# EasyEDA Pro project ProPrj_HTXStudio_OneHanded_Keyboard.epro, board 左手主控
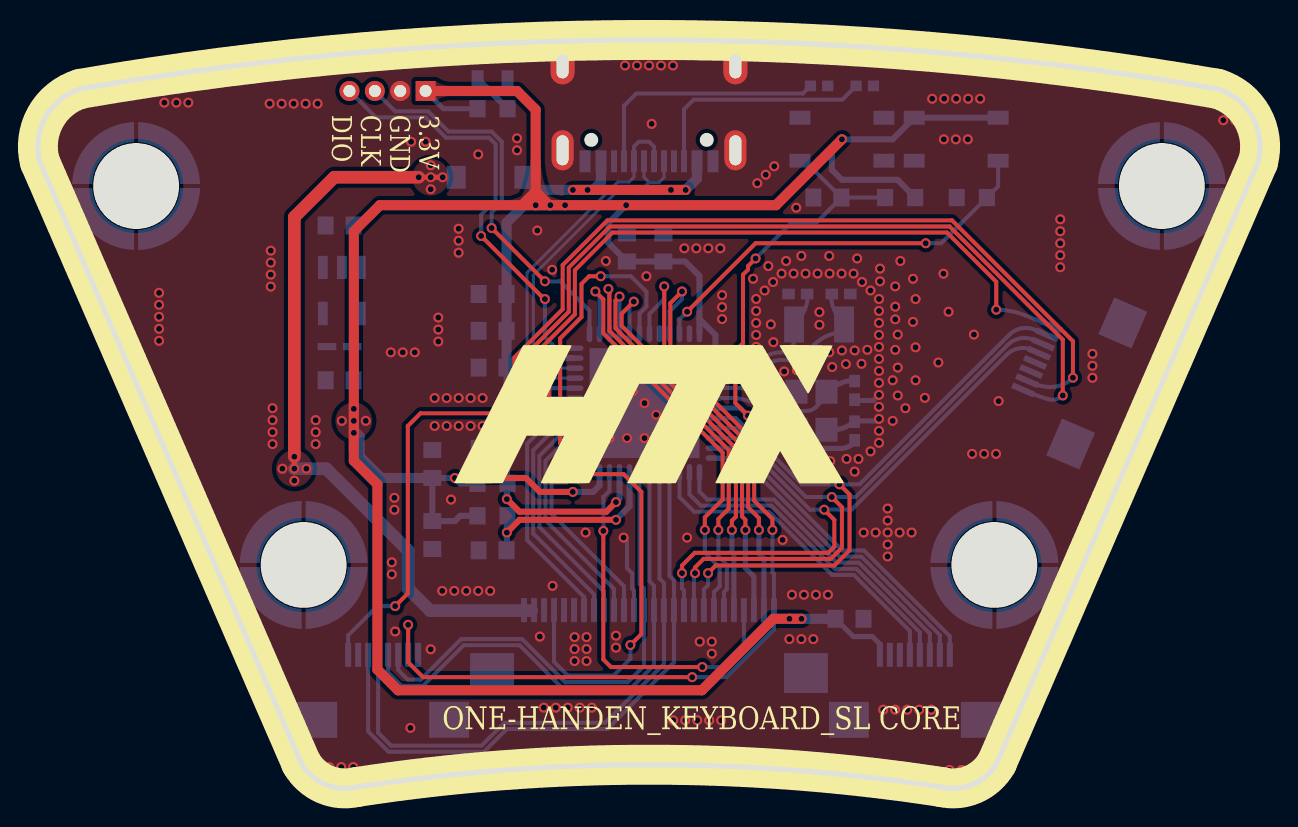
[diagram p12: board, top side]
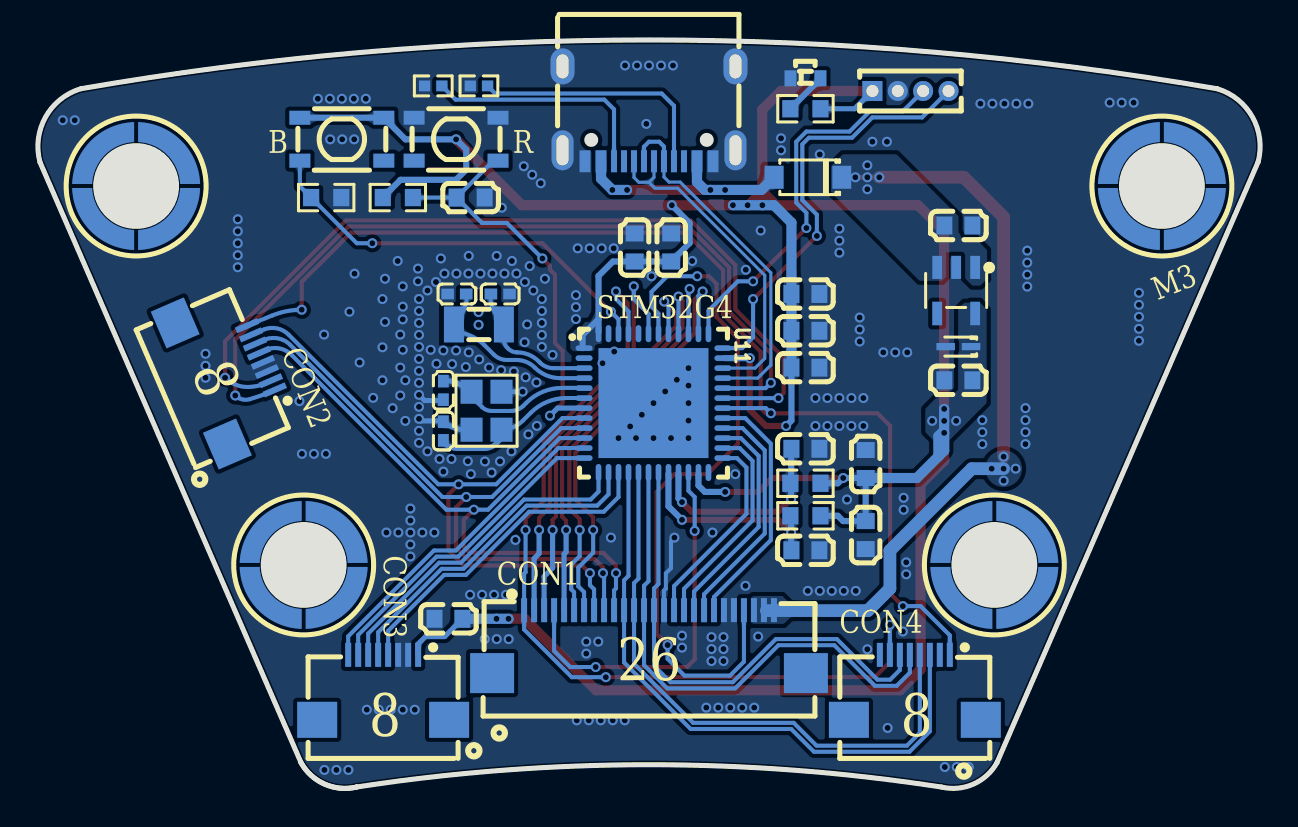
[diagram p13: board, bottom side, seen from below]

Outline 61.15 x 37.46 mm; copper layers: Top Layer, Bottom Layer. Coordinates in mm from the lower left corner of the outline.
Outline path: 45.2,0.07 arc(30.57,1.19) 15.94,0.07 arc(14.35,0.21) 13.17,1.28 0.1,31.34 arc(0.38,33.59) 2.15,35.02 arc(30.57,37.46) 59,35.02 arc(60.77,33.59) 61.04,31.34 47.98,1.28 ; 45.2,0.07 arc(46.79,0.21) 47.98,1.28 ; 45.2,0.07 arc(46.8,0.21) 47.98,1.28
Stack: Top Layer 0.035mm / Dielectric1 1.51mm FR4 er 4.5 / Bottom Layer 0.035mm

## Design rules (mm)
template: 自定义配置
spacing copperThickness1oz (default): track to track 0.102, other pairs 0.05 to 0.3
spacing copperThickness2oz: track to track 0.203, other pairs 0.152 to 0.3
track width copperThickness1oz (default): min 0.127, default 0.254, max 2.54
track width copperThickness2oz: min 0.203, default 0.254, max 2.54
differential pair differentialPair (default): width min 0.127, default 0.254, max 2.54; gap min 0.152, default 0.152
via viaSize (default): diameter min 0.4, default 0.4, max 10; hole min 0.3, default 0.3, max 6.3

## Placement (name value [footprint] x y rotation side)
C6  20pF  [C0402]  40.86 17.89 90 bottom
C7  20pF  [C0402]  40.86 19.92 90 bottom
C27  6pF  [C0402]  38.02 24.74 180 bottom
C28  6pF  [C0402]  40.18 24.74 0 bottom
C29  100nF  [C0603]  22.75 11.92 0 bottom
C30  100nF  [C0603]  19.73 12.68 270 bottom
C31  100nF  [C0603]  19.73 16.24 270 bottom
C32  100nF  [C0603]  22.75 17 180 bottom
C33  1uF  [C0603]  22.75 24.74 0 bottom
C34  100nF  [C0603]  22.75 22.9 0 bottom
C35  100nF  [C0603]  22.75 21.06 0 bottom
C36  100nF  [C0603]  39.5 29.57 0 bottom
C37  1uF  [C0603]  31.29 27.07 270 bottom
C38  100nF  [C0603]  29.46 27.07 270 bottom
C39  100nF  [C0603]  40.61 8.49 180 bottom
C40  1uF  [C0603]  15.1 28.17 0 bottom
C41  1uF  [C0603]  15.1 20.43 180 bottom
D1  DSK34  [SOD-123_L2.8-W1.8-LS3.7-RD]  22.62 30.59 0 bottom
D3  ESD5Z3V3  [SOD-523_L1.2-W0.8-LS1.6-RD]  15.1 22.11 0 bottom
FPC7  FPC-05FB-8PH20  [FPC-SMD_8P-P0.50_XUNPU_FPC-05FB-8PH20]  17.27 5.06 180 bottom
FPC8  FPC-05FB-8PH20  [FPC-SMD_8P-P0.50_XUNPU_FPC-05FB-8PH20]  43.87 5.06 180 bottom
FPC9  FPC-05FB-8PH20  [FPC-SMD_8P-P0.50_XUNPU_FPC-05FB-8PH20]  51.48 20.91 246.7 bottom
H1  PZ127V-11-04-0720  [HDR-TH_4P-P1.27-V-M]  17.49 34.9 180 bottom
LDO1  ME6211C33M5G-N  [SOT-23-5_L3.0-W1.7-P0.95-LS2.8-BL]  15.21 24.92 0 bottom
LED3  XL-1606UGC  [LED-SMD_L1.7-W1.1-R-RD_GREEN]  22.75 35.54 180 bottom
R6  5.1kΩ  [R0402]  39.08 35.16 180 bottom
R7  5.1kΩ  [R0402]  41.37 35.16 180 bottom
R10  0Ω  [R0603]  22.75 13.64 0 bottom
R11  0Ω  [R0603]  22.75 15.27 0 bottom
R12  10kΩ  [R0603]  43.14 29.57 0 bottom
R13  10kΩ  [R0603]  46.72 29.57 0 bottom
R14  1kΩ  [R0603]  22.75 34.02 0 bottom
SW1  SKRPACE010  [KEY-SMD_4P-L4.2-W3.2-P2.20-LS4.6]  40.23 32.49 180 bottom
SW2  SKRPACE010  [KEY-SMD_4P-L4.2-W3.2-P2.20-LS4.6]  45.94 32.49 180 bottom
U11  STM32G431CBU6  [VQFN-48_L7.0-W7.0-P0.50-BL-EP5.5]  30.35 19.28 270 bottom
U16  SMTSO3030CTJ  [SMD_BD5.6-D4.1]  47.85 11.18 180 bottom
U17  SMTSO3030CTJ  [SMD_BD5.6-D4.1]  13.3 11.18 180 bottom
U18  SMTSO3030CTJ  [SMD_BD5.6-D4.1]  4.91 30.15 180 bottom
U19  SMTSO3030CTJ  [SMD_BD5.6-D4.1]  56.23 30.15 180 bottom
USB1  TYPE-C 16PIN 2MD(073)  [USB-C-SMD_TYPE-C-6PIN-2MD-073]  30.57 33.76 0 bottom
X1  8MHz  [OSC-SMD_4P-L2.5-W2.0-BL]  38.7 18.9 90 bottom
X2  32.768kHz  [FC-135R_L3.2-W1.5]  39.08 23.22 180 bottom
X3  AFC24-S26FIA-00  [FPC-SMD_AFC24-S26FIA]  30.57 7.35 180 bottom

## Footprints (pads in the part's own frame, mm; a bottom-side part is the same pattern mirrored in y, then rotated)
C0402
  rect 0.63x0.54 smd: 1(-0.465,0) 2(0.465,0)
C0603
  rect 0.8x0.9 smd: 1(-0.7,0) 2(0.7,0)
FC-135R_L3.2-W1.5
  rect 1x1.8 smd: 1(-1.25,0) 2(1.25,0)
FPC-SMD_8P-P0.50_XUNPU_FPC-05FB-8PH20
  rect 0.3x1.2 smd: 1(1.75,1.625) 2(1.25,1.625) 3(0.75,1.625) 4(0.25,1.625) 5(-0.25,1.625) 6(-0.75,1.625) 7(-1.25,1.625) 8(-1.75,1.625)
  rect 2x1.8 smd: 9(-3.3,-1.625) 10(3.3,-1.625)
FPC-SMD_AFC24-S26FIA
  rect 0.3x1.2 smd: 1(-6.25,1.574) 2(-5.748,1.574) 3(-5.248,1.574) 4(-4.748,1.574) 5(-4.248,1.574) 6(-3.748,1.574) 7(-3.248,1.574) 8(-2.748,1.574) 9(-2.248,1.574) 10(-1.748,1.574) 11(-1.248,1.574) 12(-0.748,1.574) 13(-0.248,1.574) 14(0.252,1.574) 15(0.752,1.574) 16(1.252,1.574) 17(1.752,1.574) 18(2.252,1.574) 19(2.754,1.573) 20(3.252,1.574) 21(3.75,1.576) 22(4.25,1.576) 23(4.75,1.576) 24(5.25,1.576) 25(5.75,1.576) 26(6.25,1.576)
  rect 2.2x2 smd: 27(7.85,-1.576) 28(-7.85,-1.576)
HDR-TH_4P-P1.27-V-M
  rect 1x1 hole 0.6: 1(-1.905,0)
  round 1 hole 0.6: 2(-0.635,0) 3(0.635,0) 4(1.905,0)
KEY-SMD_4P-L4.2-W3.2-P2.20-LS4.6
  rect 1.05x0.7 smd: 1(-2.1,1.075) 2(2.1,1.075) 3(-2.1,-1.075) 4(2.1,-1.075)
LED-SMD_L1.7-W1.1-R-RD_GREEN
  rect 0.6x0.8 smd: 1(0.75,0) 2(-0.75,0)
OSC-SMD_4P-L2.5-W2.0-BL
  rect 1.2x1.1 smd: 1(-0.95,-0.75) 2(0.95,-0.75) 3(0.95,0.75) 4(-0.95,0.75)
R0402
  rect 0.566x0.54 smd: 1(-0.433,0) 2(0.433,0)
R0603
  rect 0.806x0.864 smd: 1(-0.753,0) 2(0.753,0)
SMD_BD5.6-D4.1
  custom 3.1x3.1 smd: 1(-2.102,1.65) 2(1.65,2.102) 3(2.102,-1.65) 4(-1.65,-2.102)
SOD-123_L2.8-W1.8-LS3.7-RD
  rect 0.95x1.15 smd: 1(-1.692,0) 2(1.692,0)
SOD-523_L1.2-W0.8-LS1.6-RD
  rect 0.93x0.36 smd: 1(-0.635,0) 2(0.635,0)
SOT-23-5_L3.0-W1.7-P0.95-LS2.8-BL
  rect 0.49x1.157 smd: 1(-0.95,-1.153) 2(0,-1.153) 3(0.95,-1.153)
  rect 0.49x1.175 smd: 4(0.95,1.153) 5(-0.95,1.153)
USB-C-SMD_TYPE-C-6PIN-2MD-073
  rect 0.55x1.1 smd: 1(-3.2,2.375) 2(-2.4,2.375) 11(2.4,2.375) 12(3.2,2.375)
  rect 0.3x1.1 smd: 3(-1.75,2.375) 4(-1.25,2.375) 5(-0.75,2.375) 6(-0.25,2.375) 7(0.25,2.375) 8(0.75,2.375) 9(1.25,2.375) 10(1.75,2.375)
  oval 1.2x1.8 hole 0.6x1.2: 13(-4.325,-2.375) 14(4.325,-2.375)
  oval 1.1x2 hole 0.6x1.5: 13(-4.325,1.825) 14(4.325,1.825)
VQFN-48_L7.0-W7.0-P0.50-BL-EP5.5
  oval 0.28x0.85 smd: 1(-2.75,-3.474) 2(-2.25,-3.474) 3(-1.75,-3.474) 4(-1.25,-3.474) 5(-0.75,-3.474) 6(-0.25,-3.474) 7(0.25,-3.474) 8(0.75,-3.474) 9(1.25,-3.474) 10(1.75,-3.474) 11(2.25,-3.474) 12(2.75,-3.474) 25(2.75,3.474) 26(2.25,3.474) 27(1.75,3.474) 28(1.25,3.474) 29(0.75,3.474) 30(0.25,3.474) 31(-0.25,3.474) 32(-0.75,3.474) 33(-1.25,3.474) 34(-1.75,3.474) 35(-2.25,3.474) 36(-2.75,3.474)
  oval 0.85x0.28 smd: 13(3.474,-2.75) 14(3.474,-2.25) 15(3.474,-1.75) 16(3.474,-1.25) 17(3.474,-0.75) 18(3.474,-0.25) 19(3.474,0.25) 20(3.474,0.75) 21(3.474,1.25) 22(3.474,1.75) 23(3.474,2.25) 24(3.474,2.75) 37(-3.474,2.75) 38(-3.474,2.25) 39(-3.474,1.75) 40(-3.474,1.25) 41(-3.474,0.75) 42(-3.474,0.25) 43(-3.474,-0.25) 44(-3.474,-0.75) 45(-3.474,-1.25) 46(-3.474,-1.75) 47(-3.474,-2.25) 48(-3.474,-2.75)
  rect 5.5x5.5 smd: 49(0,0)

## Nets
As in the schematic.

Pads without a net: FPC7 9 10; FPC8 9 10; FPC9 9 10; LDO1 4; SW1 3; SW2 4; U11 2 24 44 47; U16 1 2 3 4; U17 1 2 3 4; U18 1 2 3 4; U19 1 2 3 4; USB1 3 9; X3 27 28

## Via types
v1: diameter 0.5, hole 0.3, Top Layer to Bottom Layer, 337 vias

## Routing (per net, layer and track width the routed paths; a pad name or vN(x,y) marks a point on that pad's centre or on a via; arc(x,y) is an arc through that point)
+3.3V: length 162.3
  Top Layer w0.305: v1(25.53,21.54) 25.53,18.94 24.73,18.14 v1(23.71,18.14) ; v1(20.85,15.54) 24.41,15.54 25.11,14.84 v1(26.76,14.84)
  Top Layer w0.508: 24.22,29.19 17.11,29.19 15.8,27.89 v1(15.8,19) ; 24.22,29.19 24.9,29.87 ; 24.22,29.19 v1(24.9,29.19) ; 25.58,29.19 v1(25.63,29.19) v1(26.37,29.19) v1(29.43,29.19) 36.93,29.19 v1(40.22,32.49) ; 25.58,29.19 v1(24.9,29.19) ; 25.58,29.19 24.9,29.87 ; 15.8,18.27 v1(15.8,17.8) 15.8,16.4 16.98,15.22 16.98,5.95 18.02,4.91 33.21,4.91 36.79,8.49 v1(37.6,8.49) v1(38.2,8.49) ; v1(24.9,29.19) 24.9,29.87 ; 24.9,29.87 24.9,33.97 23.96,34.91 H1.1 ; v1(15.8,18.4) 15.8,18.87
  Bottom Layer w0.254: C39.2 40.79,7.6 41.74,7.6 42.12,7.23 FPC8.1 ; H1.1 20.28,34.02 R14.1
  Bottom Layer w0.305: R12.2 43,30.46 40.22,30.46 39.71,30.97 39.71,31.98 v1(40.22,32.49) 42.75,32.49 SW2.2 48.04,33.57 ; 33.89,22.04 33.89,22.69 33.09,23.49 ; 33.09,23.49 33.09,25.65 32.37,26.37 C37.2 C38.2 28.54,27.29 28.54,28.3 v1(29.43,29.19) ; 33.09,23.49 33.09,22.83 ; v1(23.71,18.14) 23.44,18.41 C35.2 ; R11.1 21.12,15.27 v1(20.85,15.54) C31.2 C30.1 20.85,13.38 21.12,13.65 R10.1 ; 26.8,21.54 v1(25.53,21.54) ; 28.09,15.74 28.09,15.16 27.77,14.84 v1(26.76,14.84)
  Bottom Layer w0.508: 16.09,16.62 16.09,17.63 15.87,17.86 ; 16.09,16.62 17.17,15.54 C31.2 ; 16.09,16.62 15.8,16.91 v1(15.8,17.8) v1(15.8,18.4) v1(15.8,19) ; C39.2 v1(38.2,8.49) v1(37.6,8.49) ; v1(26.37,29.19) v1(25.63,29.19) v1(24.9,29.19) 24.32,29.19 23.44,28.32 C33.2 C34.2 C35.2
  vias: v1(15.21,18.39) v1(16.41,18.39)
GND: length 9
  Bottom Layer w0.203: 29.82,8.92 29.82,9.9 29.72,10 29.72,10.77 29.47,11.02 29.47,12.37 29.28,12.56
  Bottom Layer w0.254: v1(42.08,19.7) 41.79,19.41 40.86,19.41 ; v1(42.08,18.5) 41.97,18.39 40.86,18.39 arc(40.37,18.07) 39.79,17.95 X1.4 ; X1.2 36.9,19.85 arc(36.89,19.85) v1(36.89,19.86)
  vias: v1(6.06,24.8) v1(6.06,24.2) v1(6.06,23.6) v1(6.06,23) v1(6.06,22.4) v1(6.33,34.32) v1(6.93,34.32) v1(7.53,34.32) v1(11.59,34.27) v1(11.65,26.91) v1(11.65,26.31) v1(11.65,25.71) v1(11.65,25.11) v1(11.74,19.03) v1(11.74,18.43) v1(11.74,17.83) v1(11.74,17.23) v1(12.19,34.27) v1(12.79,34.27) v1(13.39,34.27) v1(13.9,18.43) v1(13.9,17.83) v1(13.9,17.23) v1(13.99,34.27) v1(14.58,1.07) v1(15.18,1.07) v1(15.78,1.07) v1(17.65,21.82) v1(17.71,11.32) v1(17.71,10.72) v1(17.84,14.54) v1(17.84,13.94) v1(17.87,7.85) v1(18.25,21.82) v1(18.67,32.36) v1(18.64,3.03) v1(18.85,21.82) v1(19.4,32.36) v1(19.65,6.96) v1(19.85,19.54) v1(19.85,18.14) v1(20.03,23.57) v1(20.03,22.97) v1(20.03,22.37) v1(20.23,9.89) v1(20.45,19.54) v1(20.45,18.14) v1(20.67,14.46) v1(20.83,9.89) v1(21.05,28.01) v1(21.05,27.41) v1(21.05,26.81) v1(21.05,19.54) v1(21.05,18.14) v1(21.43,9.89) v1(21.65,19.54) v1(21.65,18.14) v1(22.03,31.73) v1(22.03,9.89) v1(22.25,19.54) v1(22.25,18.14) v1(22.63,9.89) v1(23.97,32.54) v1(23.97,31.94) v1(24.99,27.92) v1(25.11,7.6) v1(25.31,4.04) v1(25.73,25.96) v1(25.75,10.14) v1(25.91,4.04) v1(26.26,15.73) v1(26.51,4.04) v1(26.85,7.57) v1(26.85,6.97) v1(26.85,6.37) v1(27.11,4.04) v1(27.4,12.81) v1(27.45,7.57) v1(27.45,6.97) v1(27.45,6.37) v1(27.71,4.04) v1(28.41,26.4) v1(28.6,21.03) v1(28.6,20.16) v1(28.6,19.28) v1(28.6,18.41) v1(28.6,17.53) v1(28.92,7.65) v1(28.92,7.05) v1(29.18,20.45) v1(29.3,12.55) v1(29.37,36.18) v1(29.47,17.53) v1(29.76,19.87) v1(29.97,36.18) v1(30.35,19.28) v1(30.35,17.53) v1(30.45,25.63) v1(30.57,36.18) v1(30.71,33.26) v1(30.93,18.7) v1(31.17,36.18) v1(31.22,17.53) v1(31.52,18.12) v1(31.77,36.18) v1(31.79,3.41) v1(32.1,17.53) v1(32.31,21.86) v1(32.34,27.03) v1(32.39,3.41) v1(32.48,12.55) v1(32.9,21.28) v1(32.94,27.03) v1(32.99,3.41) v1(33.11,7.35) v1(33.54,27.03) v1(33.59,3.41) v1(33.71,7.35) v1(33.71,6.75) v1(34.14,27.03) v1(34.19,3.41) v1(34.23,24.69) v1(34.23,24.09) v1(34.23,23.49) v1(35.4,21.7) v1(35.78,25.51) v1(35.99,30.29) v1(35.93,24.49) v1(35.93,23.89) v1(35.93,23.29) v1(35.93,22.69) v1(35.93,22.09) v1(36.2,20.32) v1(36.18,18.14) v1(36.42,30.71) v1(36.36,24.92) v1(36.54,26.14) v1(36.61,17.72) v1(36.67,23.22) v1(36.78,25.34) v1(36.8,22.33) v1(36.75,20.58) v1(36.84,31.14) v1(37.21,25.77) v1(37.26,12.44) v1(37.34,20.87) v1(37.43,26.4) v1(37.46,16.87) v1(37.59,7.47) v1(37.81,25.77) v1(37.73,9.69) v1(37.94,29.06) v1(37.97,20.93) v1(38.03,16.37) v1(38.19,26.65) v1(38.19,7.47) v1(38.41,25.77) v1(38.33,9.69) v1(38.45,15.81) v1(38.57,21.06) v1(38.78,16.36) v1(38.79,7.47) v1(39.01,25.77) v1(38.93,9.69) v1(39.1,23.84) v1(39.1,23.2) v1(39.07,21.47) v1(39.49,15.73) v1(39.59,26.65) v1(39.61,25.77) v1(39.59,21.82) v1(39.53,9.69) v1(39.64,16.38) v1(39.74,21.09) v1(40.21,25.77) v1(40.23,21.92) v1(40.43,21.24) v1(40.46,16.49) v1(40.81,25.77) v1(40.86,21.92) v1(40.86,15.85) v1(40.99,26.52) v1(41.06,16.49) v1(41.21,21.25) v1(41.23,25.34) v1(41.31,12.81) v1(41.5,21.95) v1(41.66,24.92) v1(41.66,16.87) v1(41.91,12.81) v1(42.08,24.49) v1(42.08,23.89) v1(42.08,23.29) v1(42.08,22.69) v1(42.08,22.09) v1(42.08,21.49) v1(42.08,20.89) v1(42.08,20.29) v1(42.08,19.09) v1(42.08,17.89) v1(42.08,17.29) v1(42.13,26.01) v1(42.13,25.38) v1(42.29,3.94) v1(42.51,14.01) v1(42.51,13.41) v1(42.51,12.81) v1(42.51,12.21) v1(42.51,11.61) v1(42.77,20.43) v1(42.77,18.39) v1(42.89,25.13) v1(42.89,24.11) v1(42.89,23.47) v1(42.89,21.95) v1(42.89,3.94) v1(43.02,22.71) v1(43.02,21.06) v1(43.02,19.66) v1(43.11,12.81) v1(43.15,26.4) v1(43.4,19.03) v1(43.49,3.94) v1(43.71,12.81) v1(43.78,25.51) v1(43.78,23.35) v1(43.91,24.49) v1(43.91,22.08) v1(43.91,20.43) v1(44.09,3.94) v1(44.37,19.55) v1(44.69,3.94) v1(44.74,34.52) v1(45.05,21.32) v1(45.31,25.76) v1(45.34,34.52) v1(45.32,32.48) v1(45.56,23.86) v1(45.61,0.92) v1(45.92,32.48) v1(45.94,34.52) v1(46.21,0.92) v1(46.52,32.48) v1(46.54,34.52) v1(46.74,16.74) v1(46.81,0.92) v1(46.83,22.71) v1(47.14,34.52) v1(47.34,16.74) v1(47.94,16.74) v1(48.06,19.38) v1(51.15,28.48) v1(51.15,27.88) v1(51.15,27.28) v1(51.15,26.68) v1(51.15,26.08) v1(52.76,21.75) v1(52.76,21.15) v1(52.76,20.55) v1(59.3,33.44) v1(59.9,33.44)
VBUS: length 36.8
  Top Layer w0.254: v1(19.05,30.59) v1(19.65,30.59) v1(20.25,30.59) ; v1(12.83,16) v1(12.83,16.6)
  Top Layer w0.635: v1(12.83,16.6) 12.83,28.59 14.82,30.59 v1(19.05,30.59)
  Bottom Layer w0.635: v1(12.83,16) v1(13.43,16) 14.43,16 18.52,11.9 18.52,10 19.62,8.9 24.7,8.9
  vias: v1(12.23,16) v1(12.83,15.4) v1(19.65,31.19) v1(19.65,29.99)
VDDA: length 9.9
  Top Layer w0.305: v1(28.92,14.33) 28.44,13.85 24.09,13.85 v1(23.46,14.48)
  Bottom Layer w0.305: 29.09,15.74 29.09,14.51 v1(28.92,14.33) ; C32.1 23.46,16.98 v1(23.46,14.48)
ADNS9800_CS: length 15.9
  Bottom Layer w0.203: FPC8.7 45.12,7.68 41.2,11.6 40.11,11.6 35.18,16.53 33.9,16.53
ADNS9800_MOTION: length 16.6
  Bottom Layer w0.203: FPC8.8 45.62,7.61 41.32,11.91 40.23,11.91 35.1,17.04 33.89,17.04
BOOT0: length 20.6
  Top Layer w0.203: v1(32.48,23.86) 35.91,27.28 v1(44.42,27.28)
  Bottom Layer w0.203: v1(44.41,27.29) 45.19,27.29 R13.2 48.04,30.14 48.04,31.42 ; 32.09,22.83 32.09,23.48 v1(32.47,23.86)
COL1: length 34.2
  Top Layer w0.203: v1(40.1,15.22) 40.61,14.71 40.61,11.92 39.84,11.16 33.91,11.16 v1(33.53,10.77)
  Bottom Layer w0.203: X3.8 33.32,9.97 33.52,10.17 v1(33.52,10.78) ; 33.89,18.54 34.9,18.54 38.21,15.22 v1(40.09,15.22) 41.11,15.22 48.6,22.71 arc(49.17,23.02) 49.81,22.98 arc(50.15,22.84) 50.48,22.7
COL2: length 33.4
  Top Layer w0.203: v1(39.72,14.58) 40.23,14.08 40.23,12.04 39.67,11.49 33.3,11.49 32.88,11.06 v1(32.88,10.77)
  Bottom Layer w0.203: X3.9 32.82,10.72 v1(32.87,10.78) ; 33.89,18.04 34.97,18.04 38.42,14.59 v1(39.71,14.59) 40.91,14.59 48.53,22.21 arc(49.19,22.53) 49.91,22.4
COL3: length 33.3
  Top Layer w0.203: v1(32.22,10.77) 32.22,11.16 32.86,11.79 39.54,11.79 39.84,12.09 39.84,13.44 v1(39.34,13.95)
  Bottom Layer w0.203: 33.89,17.53 35.04,17.53 38.62,13.95 v1(39.33,13.95) 40.7,13.95 48.45,21.7 arc(49.23,22.04) 50.04,21.77 ; v1(32.22,10.78) 32.22,10.01 32.32,9.92 X3.10
COL4: length 30.9
  Bottom Layer w0.203: 31.59,15.74 31.59,10.64 31.82,10.42 X3.11 31.82,6.31 28.49,2.98 23.46,2.98 22.31,1.83 17.54,1.83 16.52,2.85 FPC7.3
COL5: length 29.8
  Bottom Layer w0.203: FPC7.4 17.02,2.78 17.67,2.14 22.19,2.14 23.33,3.28 28.36,3.28 31.32,6.24 X3.12 31.32,10.28 31.1,10.5 31.1,15.74
COL6: length 26.3
  Bottom Layer w0.203: FPC7.5 17.52,5.79 18.17,5.14 19.27,5.14 21.3,7.17 24.09,7.17 26.25,5.01 29.65,5.01 30.82,6.17 X3.13 30.82,10.15 30.59,10.37 30.59,15.74
COL7: length 25
  Bottom Layer w0.203: FPC7.6 18.02,5.93 18.51,5.44 19.14,5.44 21.18,7.47 24.22,7.47 26.38,5.31 29.5,5.31 30.32,6.14 X3.14 30.32,10.01 30.1,10.23 30.1,15.74
COL8: length 44.6
  Top Layer w0.203: v1(36.74,12.93) 36.74,13.49 35.83,14.4 35.83,17.38 31.64,21.58 31.64,24.29 v1(32.22,24.87) ; v1(18.52,8.19) 18.52,6.32 19.27,5.57 v1(32.73,5.57)
  Bottom Layer w0.203: 31.59,22.83 31.59,23.87 32.22,24.49 v1(32.22,24.87) ; v1(32.73,5.57) 34.43,5.57 36.82,7.96 X3.1 36.82,10.75 36.74,10.82 v1(36.74,12.93) ; FPC7.7 v1(18.52,8.19)
COL9: length 20.9
  Top Layer w0.203: v1(31.33,25.13) 31.33,21.45 35.53,17.26 35.53,14.07 36.07,13.53 v1(36.07,12.93)
  Bottom Layer w0.203: 30.6,22.83 30.6,23.75 31.34,24.49 v1(31.34,25.13)
  Bottom Layer w0.254: X3.2 36.32,11.5 36.07,11.75 v1(36.07,12.93)
COL10: length 20.1
  Top Layer w0.203: v1(35.4,12.93) 35.4,13.44 35.23,13.61 35.23,17.13 29.2,23.15 29.2,23.75 v1(29.81,24.36)
  Bottom Layer w0.203: 29.6,22.83 29.6,24.15 v1(29.81,24.36)
  Bottom Layer w0.254: v1(35.39,12.93) 35.39,11.03 35.82,10.61 X3.3
COL11: length 19
  Top Layer w0.203: v1(33.24,6.08) 28.66,6.08 28.28,6.46 v1(28.28,12.89)
  Bottom Layer w0.203: X3.4 35.32,6.89 34.51,6.08 v1(33.24,6.08) ; v1(28.28,12.89) 28.28,14.59 28.59,14.9 28.59,15.74
COL12: length 20.2
  Top Layer w0.203: v1(29.09,24.62) 28.89,24.42 28.89,23.03 34.92,17 34.92,13.6 34.72,13.4 v1(34.72,12.93)
  Bottom Layer w0.203: 29.1,22.83 v1(29.1,24.62)
  Bottom Layer w0.254: X3.5 34.82,11.73 34.72,11.83 v1(34.72,12.93)
COL13: length 21.2
  Top Layer w0.203: v1(28.54,25) 28.59,24.95 28.59,22.9 34.56,16.93 34.56,14 34.04,13.48 v1(34.04,12.93)
  Bottom Layer w0.203: v1(28.54,25) 28.6,24.94 28.6,24.83 28.59,24.83 28.59,24.41 28.6,24.41 28.6,22.83 ; v1(34.04,12.93) 34.04,11.62 34.47,11.2 34.47,9.97 34.32,9.82 X3.6
COL14: length 21.5
  Top Layer w0.203: v1(27.89,24.87) 28.29,24.47 28.29,22.78 34.26,16.81 34.26,14.46 33.37,13.57 v1(33.37,12.93)
  Bottom Layer w0.203: v1(27.88,24.87) 28.09,24.66 28.09,22.83 ; X3.7 33.82,9.83 34.11,10.12 34.11,11.05 33.36,11.8 v1(33.36,12.93)
ENCODER_A: length 43.6
  Top Layer w0.203: v1(24.1,19.53) 23.84,19.79 23.84,21.57 26.26,23.98 26.26,26.19 28.49,28.43 45.74,28.43 51.78,22.38 v1(51.78,20.55)
  Bottom Layer w0.203: 26.8,19.53 v1(24.09,19.53) ; 49.55,20.36 arc(50.07,20.17) 50.61,20.09 arc(51.24,20.2) v1(51.78,20.55)
ENCODER_B: length 41.9
  Top Layer w0.203: v1(24.48,20.3) 24.48,21.77 26.56,23.86 26.56,26.07 28.62,28.12 45.61,28.12 51.27,22.46 v1(51.27,19.66)
  Bottom Layer w0.203: v1(24.48,20.3) 24.74,20.03 26.8,20.03 ; 51.27,19.66 arc(50.94,19.47) 50.55,19.48 arc(49.91,19.69) 49.29,19.93
NRST: length 20.9
  Top Layer w0.203: v1(35.91,26.52) 35.53,26.14 35.53,25.96 35.28,25.71 35.28,22.29 34.9,21.9 34.9,19.28 v1(35.53,18.65)
  Bottom Layer w0.203: C36.2 38.92,28.3 37.68,28.3 v1(35.9,26.52) ; C36.2 38.35,31.42 SW1.4 ; C36.2 R12.1
  Bottom Layer w0.254: 33.9,19.04 35.15,19.04 v1(35.53,18.65)
OSC32_IN: length 7
  Bottom Layer w0.203: 33.9,21.03 35.35,21.03 arc(35.72,21.11) 36.03,21.32 36.09,21.37 arc(36.59,21.71) 37.18,21.82 arc(37.41,21.87) 37.61,22 37.69,22.08 arc(37.79,22.24) 37.83,22.43 X2.2 37.94,23.33 arc(38.37,23.98) 38.53,24.74
OSC32_OUT: length 8.8
  Bottom Layer w0.203: X2.1 40.29,23.26 arc(39.84,23.94) 39.68,24.74 ; 33.9,20.53 35.01,20.53 arc(35.7,20.67) 36.29,21.06 arc(36.71,21.34) 37.21,21.44 37.69,21.44 arc(38.04,21.51) 38.34,21.71 38.81,22.19 arc(39.52,22.66) 40.35,22.84
OSC_IN: length 8
  Bottom Layer w0.203: 33.89,20.04 34.91,20.04 arc(35.88,19.85) 36.71,19.3 36.86,19.15 arc(37.15,18.96) 37.48,18.89 38.46,18.89 arc(38.71,18.94) 38.93,19.09 39.27,19.42 arc(39.4,19.63) 39.45,19.86
  Bottom Layer w0.254: 39.47,19.77 39.58,19.89 arc(40.17,20.28) 40.86,20.42
OSC_OUT: length 8
  Bottom Layer w0.203: 33.89,19.54 34.7,19.54 arc(35.67,19.35) 36.49,18.8 36.88,18.41 arc(37.38,18.07) 37.96,17.96
  Bottom Layer w0.254: 37.73,17.75 38.23,17.25 arc(38.49,17.08) 38.8,17.01 40.14,17.01 arc(40.53,17.09) 40.86,17.31
PA5: length 16.4
  Bottom Layer w0.203: 33.09,15.74 33.09,14.85 33.49,14.46 36.82,14.46 39.98,11.3 41.07,11.3 44.62,7.75 FPC8.6
PA6: length 16.5
  Bottom Layer w0.203: FPC8.5 44.12,7.82 40.95,10.99 39.86,10.99 36.7,14.15 33.16,14.15 32.6,14.72 32.6,15.74
PA7: length 16.7
  Bottom Layer w0.203: 32.1,15.74 32.1,14.58 32.83,13.85 36.57,13.85 39.73,10.69 40.82,10.69 43.62,7.88 FPC8.4
PA8: length 57.3
  Top Layer w0.203: v1(47.94,23.96) 47.94,25.36 45.48,27.82 28.74,27.82 26.86,25.94 26.86,23.73 24.99,21.86 24.99,19.04 24.73,18.78 v1(24.47,18.78) 19.14,18.78 18.5,18.14 18.5,9.76 v1(17.87,9.12)
  Bottom Layer w0.203: 50.67,23.16 49.42,23.67 arc(48.69,23.88) 47.94,23.96 ; 26.8,19.04 24.73,19.04 v1(24.47,18.78) ; FPC7.1 15.52,7.66 16.98,9.12 v1(17.87,9.12)
PB4: length 35
  Top Layer w0.203: v1(29.64,7.18) 30.19,7.73 30.19,14.84 29.3,15.73 27.65,15.73 26.12,17.25 26.12,22.53 27.19,23.59 27.19,25.25 27.57,25.63 v1(28.16,25.63)
  Bottom Layer w0.203: v1(28.16,25.63) 29.66,25.63 30.44,24.86 30.44,24.11 30.1,23.76 30.1,22.83 ; X3.23 25.82,6.34 26.51,5.65 28.79,5.65 29.64,6.49 v1(29.64,7.18)
PB12: length 9.9
  Bottom Layer w0.203: X3.16 29.32,10.12 25.69,13.75 25.69,16.06 26.17,16.53 26.8,16.53
PB13: length 10.6
  Bottom Layer w0.203: 26.8,17.03 26.03,17.03 25.39,16.39 25.39,13.42 28.82,9.99 X3.17
PB14: length 11.1
  Bottom Layer w0.203: X3.18 28.32,9.85 25.08,13.09 25.08,16.64 25.97,17.53 26.8,17.53
PB15: length 11.7
  Bottom Layer w0.203: X3.19 27.82,9.72 24.78,12.76 24.78,16.92 25.89,18.03 26.8,18.03
PC6: length 12.4
  Bottom Layer w0.203: X3.20 27.32,9.58 24.47,12.43 24.47,17.25 25.76,18.54 26.8,18.54
SWCLK: length 19.6
  Top Layer w0.203: v1(25.37,25.38) v1(22.7,28.05)
  Bottom Layer w0.203: v1(22.69,28.05) 22.69,28.81 23.2,29.32 23.2,32.37 22.69,32.87 20.54,32.87 19.52,33.89 17.87,33.89 H1.3 ; v1(25.36,25.38) 26.12,25.38 27.59,23.91 27.59,22.83
SWDIO: length 21.4
  Top Layer w0.203: v1(22.17,27.65) 25.33,24.49 v1(25.36,24.49)
  Bottom Layer w0.203: v1(25.36,24.49) 25.36,22.59 25.91,22.04 26.8,22.04 ; v1(22.17,27.65) 22.17,28.72 22.9,29.44 22.9,32.24 22.57,32.57 20.41,32.57 19.39,33.58 16.9,33.58 H1.4
USB_DM: length 18
  Bottom Layer w0.152: USB1.5 29.82,30.6 29.57,30.35 29.01,30.35 24.47,25.81 24.47,21.19 25.13,20.53 26.8,20.53
  Bottom Layer w0.203: USB1.5 29.82,32.12 30.06,32.37 30.57,32.37 30.82,32.11 30.82,31.39 USB1.7
USB_DP: length 16.9
  Bottom Layer w0.152: 30.57,30.33 30.28,30.04 29.13,30.04 24.78,25.69 24.78,21.52 25.26,21.03 26.8,21.03 ; 30.57,30.33 30.32,30.58 USB1.6 ; 30.57,30.33 31.08,30.33 31.32,30.58 USB1.8
VREF: length 10
  Top Layer w0.305: v1(23.46,12.81) 24.09,13.44 v1(28.92,13.44)
  Bottom Layer w0.305: v1(28.92,13.44) 29.59,14.12 29.59,15.74 ; R10.2 23.46,13.61 v1(23.46,12.81) 23.46,11.93 C29.2
$1N2982: length 12.5
  Bottom Layer w0.203: USB1.4 29.32,34.16 29.93,34.78 38.26,34.78 R6.2
$1N2983: length 11.7
  Bottom Layer w0.203: R7.2 40.25,34.47 32.81,34.47 32.32,33.99 USB1.10
$1N2991: length 13.4
  Top Layer w0.508: v1(32.4,29.95) v1(31.67,29.95) v1(27.5,29.95) v1(26.76,29.95)
  Bottom Layer w0.508: D1.2 24.94,29.95 v1(26.76,29.95) v1(27.5,29.95) 27.77,29.95 28.17,30.35 USB1.2 ; v1(31.67,29.95) v1(32.4,29.95) 32.97,30.52 USB1.11
$1N3210: length 2.1
  Bottom Layer w0.305: LED3.1 22,35.52 R14.2

## Copper pours and planes (outline as drawn; the poured copper is in the pictures)
+3.3V on Top Layer: 16.72,18.48 16.69,18.66 16.62,18.83 16.52,18.98 16.39,19.11 16.24,19.21 16.07,19.27 15.9,19.31 15.72,19.31 15.54,19.27 15.37,19.21 15.22,19.11 15.09,18.98 14.99,18.83 14.93,18.66 14.89,18.48 14.89,18.3 14.93,18.13 14.99,17.96 15.09,17.81 15.22,17.68 15.37,17.58 15.54,17.51 15.72,17.48 15.9,17.48 16.07,17.51 16.24,17.58 16.39,17.68 16.52,17.81 16.62,17.96 16.69,18.13 16.72,18.3
+3.3V on Bottom Layer: 13.68,19.29 15.64,17.33 16.25,17.33 16.75,17.83 16.75,19 16.2,19.56 16.2,19.56 16.1,19.66 15.41,19.66 15.11,19.96 15.11,23.99 14.79,24.31 14,24.31 13.68,23.98
+3.3V on Bottom Layer: 32.86,22.33 33.31,21.88 34.38,21.88 34.51,22.01 34.51,22.71 33.88,23.35 33.11,23.35 32.86,23.09
GND on Top Layer: 13.17,1.28 14.35,0.21 15.94,0.07 30.57,1.19 45.2,0.07 46.8,0.21 47.98,1.28 61.04,31.34 60.77,33.59 59,35.02 30.57,37.46 2.15,35.02 0.38,33.59 0.1,31.34
GND on Bottom Layer: 13.17,1.28 14.35,0.21 15.94,0.07 30.57,1.19 45.2,0.07 46.8,0.21 47.98,1.28 61.04,31.34 60.77,33.59 59,35.02 30.57,37.46 2.15,35.02 0.38,33.59 0.1,31.34
VBUS on Top Layer: 13.75,16.09 13.71,16.27 13.64,16.43 13.54,16.58 13.42,16.71 13.27,16.81 13.1,16.88 12.92,16.92 12.74,16.92 12.56,16.88 12.4,16.81 12.25,16.71 12.12,16.58 12.02,16.43 11.95,16.27 11.92,16.09 11.92,15.91 11.95,15.73 12.02,15.57 12.12,15.42 12.25,15.29 12.4,15.19 12.56,15.12 12.74,15.08 12.92,15.08 13.1,15.12 13.27,15.19 13.42,15.29 13.54,15.42 13.64,15.57 13.71,15.73 13.75,15.91
VBUS on Top Layer: 20.57,30.68 20.53,30.85 20.46,31.02 20.36,31.17 20.24,31.3 20.09,31.4 19.92,31.47 19.74,31.5 19.56,31.5 19.38,31.47 19.22,31.4 19.07,31.3 18.94,31.17 18.84,31.02 18.77,30.85 18.74,30.68 18.74,30.5 18.77,30.32 18.84,30.15 18.94,30 19.07,29.87 19.22,29.77 19.38,29.71 19.56,29.67 19.74,29.67 19.92,29.71 20.09,29.77 20.24,29.87 20.36,30 20.46,30.15 20.53,30.32 20.57,30.5
VBUS on Bottom Layer: 14.4,25.16 13.99,25.16 13.66,25.49 13.66,26.95 14.29,27.58 14.84,27.58 15.09,27.82 15.09,28.63 18.19,31.74 20.87,31.74 21.47,31.14 21.47,29.83 17.04,25.41 15.91,25.41 15.71,25.6 15.71,26.82 14.79,26.82 14.79,25.56
VBUS on Bottom Layer: 23.16,8.9 23.9,9.63 25.37,9.63 25.49,9.5 25.49,8.36 25.37,8.23 23.83,8.23
VBUS on Bottom Layer: 13.75,16.09 13.71,16.27 13.64,16.43 13.54,16.58 13.42,16.71 13.27,16.81 13.1,16.88 12.92,16.92 12.74,16.92 12.56,16.88 12.4,16.81 12.25,16.71 12.12,16.58 12.02,16.43 11.95,16.27 11.92,16.09 11.92,15.91 11.95,15.73 12.02,15.57 12.12,15.42 12.25,15.29 12.4,15.19 12.56,15.12 12.74,15.08 12.92,15.08 13.1,15.12 13.27,15.19 13.42,15.29 13.54,15.42 13.64,15.57 13.71,15.73 13.75,15.91

Small or netless copper shapes (teardrops, artwork), in the pictures only: 49 on Top Layer, 127 on Bottom Layer

## Text on the board
Bottom Silkscreen Layer: CON2 | M3 | CON4 | STM32G4 | R | CON1 | B | CON3 | 8 | 26
Top Silkscreen Layer: DIO | CLK | GND | 3.3V | ONE-HANDEN_KEYBOARD_SL CORE
